# Altium schematic sheet TDC.SchDoc: FMC_ADC
size 420 x 297 mm; Author: G.Kasprowicz; CompanyName: WUT ISE; DrawnBy: G.Kasprowicz; Organization: WUT ISE; Address1: PW ISE; Address2: Nowowiejska 15/19 00-665 Warsaw; Address3: gkasprow@gmail.com; Revision: 2; SheetNumber: -; SheetTotal: -; ModifiedBy: -; CheckedDate: -; Title2: quad TDC; DivGrp: WUT ISE; Designer: G.Kasprowicz; ModifiedDate: -; ProjectName: Sensor Box
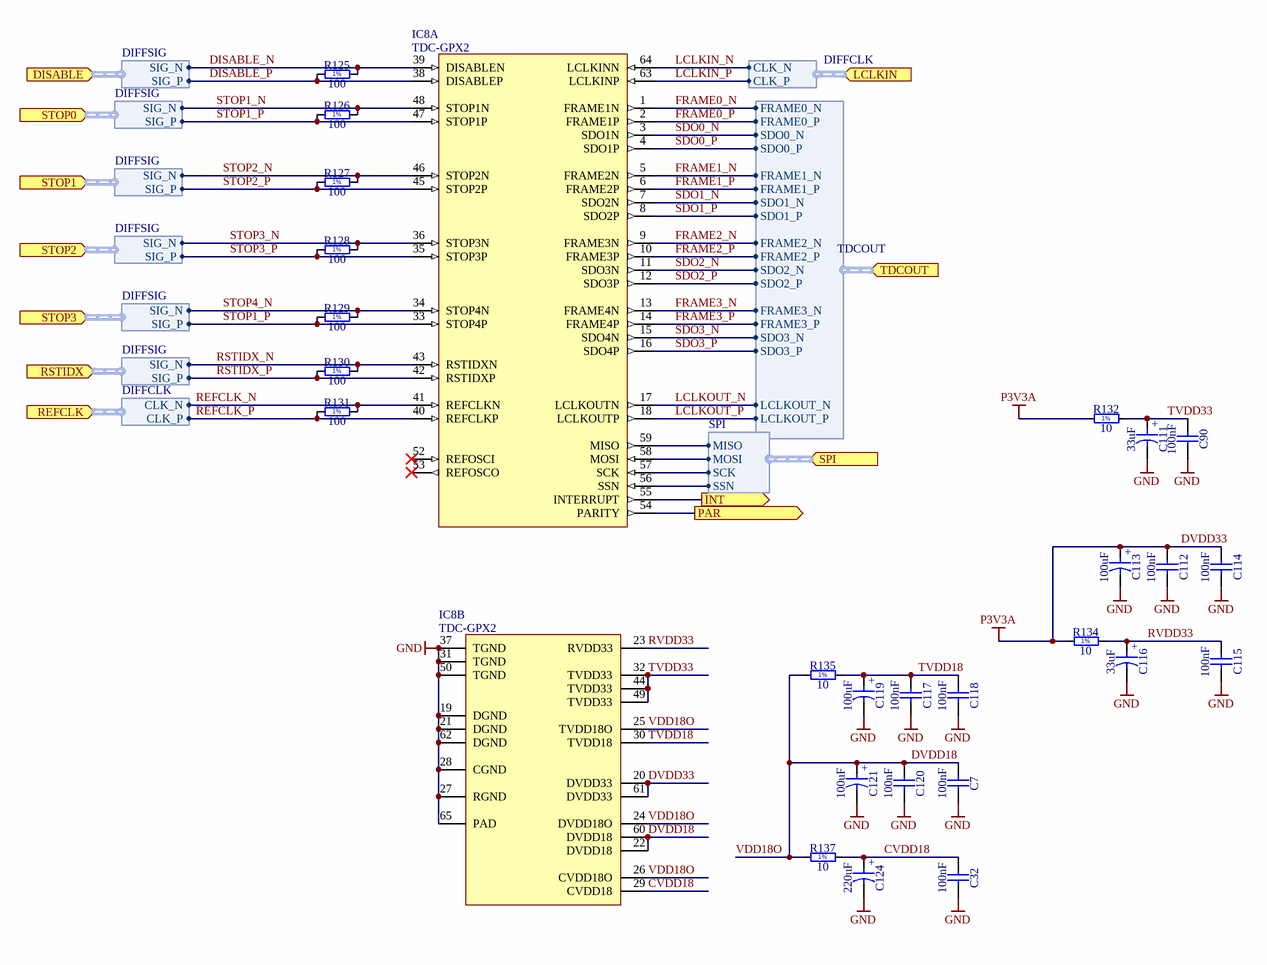
[diagram p0: TDC.SchDoc]

## Parts
C7  100nF  [CAPC0603X33N]
C32  100nF  [CAPC0603X33N]
C90  100nF  [CAPC0603X33N]
C111  33uF  [CAPMP3216X180N]
C112  100nF  [CAPC0603X33N]
C113  100uF  [CAPMP3216X180N]
C114  100nF  [CAPC0603X33N]
C115  100nF  [CAPC0603X33N]
C116  33uF  [CAPMP3216X180N]
C117  100nF  [CAPC0603X33N]
C118  100nF  [CAPC0603X33N]
C119  100uF  [CAPMP3216X180N]
C120  100nF  [CAPC0603X33N]
C121  100uF  [CAPMP3216X180N]
C124  220uF  [CAPMP3528X210N]
IC8  TDC-GPX2  [QFN50P900X900X100-65N-S615]  (parts A,B of 2)
R125  100  [RESC0603X28N]
R126  100  [RESC0603X28N]
R127  100  [RESC0603X28N]
R128  100  [RESC0603X28N]
R129  100  [RESC0603X28N]
R130  100  [RESC0603X28N]
R131  100  [RESC0603X28N]
R132  10  [RESC1005X40N]
R134  10  [RESC1005X40N]
R135  10  [RESC1005X40N]
R137  10  [RESC1005X40N]

## Ports
DISABLE (in, harness DIFFSIG), INT (out), LCLKIN (in, harness DIFFCLK), PAR (out), REFCLK (in, harness DIFFCLK), RSTIDX (in, harness DIFFSIG), SPI (in, harness SPI), STOP0 (in, harness DIFFSIG), STOP1 (in, harness DIFFSIG), STOP2 (in, harness DIFFSIG), STOP3 (in, harness DIFFSIG), TDCOUT (in, harness TDCOUT)

## Harnesses
DIFFCLK: CLK_P, CLK_N
TDCOUT: FRAME0_N, FRAME0_P, SDO0_N, SDO0_P, FRAME1_N, FRAME1_P, SDO1_N, SDO1_P, FRAME2_N, FRAME2_P, SDO2_N, SDO2_P, FRAME3_N, FRAME3_P, SDO3_N, SDO3_P, LCLKOUT_N, LCLKOUT_P
SPI: MISO, MOSI, SCK, SSN
DIFFSIG: SIG_P, SIG_N

## Nets
DVDD33: C112.1 C113.1 C114.1 IC8.20(DVDD33) IC8.61(DVDD33) R132.1 R134.1  [also labelled P3V3A]
GND: C7.2 C32.2 C90.2 C111.2 C112.2 C113.2 C114.2 C115.2 C116.2 C117.2 C118.2 C119.2 C120.2 C121.2 C124.2 IC8.19(DGND) IC8.21(DGND) IC8.27(RGND) IC8.28(CGND) IC8.31(TGND) IC8.37(TGND) IC8.50(TGND) IC8.62(DGND) IC8.65(PAD)
CVDD18: C32.1 C124.1 IC8.29(CVDD18) R137.2
DISABLE_N: IC8.39(DISABLEN) R125.2 ; port DISABLE.SIG_N
DISABLE_P: IC8.38(DISABLEP) R125.1 ; port DISABLE.SIG_P
DVDD18: C7.1 C120.1 C121.1 IC8.22(DVDD18) IC8.24(DVDD18O) IC8.25(TVDD18O) IC8.26(CVDD18O) IC8.60(DVDD18) R135.1 R137.1  [also labelled VDD18O]
FRAME0_N: IC8.1(FRAME1N) ; port TDCOUT.FRAME0_N
FRAME0_P: IC8.2(FRAME1P) ; port TDCOUT.FRAME0_P
FRAME1_N: IC8.5(FRAME2N) ; port TDCOUT.FRAME1_N
FRAME1_P: IC8.6(FRAME2P) ; port TDCOUT.FRAME1_P
FRAME2_N: IC8.9(FRAME3N) ; port TDCOUT.FRAME2_N
FRAME2_P: IC8.10(FRAME3P) ; port TDCOUT.FRAME2_P
FRAME3_N: IC8.13(FRAME4N) ; port TDCOUT.FRAME3_N
FRAME3_P: IC8.14(FRAME4P) ; port TDCOUT.FRAME3_P
INT: IC8.55(INTERRUPT) ; port INT
LCLKIN_N: IC8.64(LCLKINN) ; port LCLKIN.CLK_N
LCLKIN_P: IC8.63(LCLKINP) ; port LCLKIN.CLK_P
LCLKOUT_N: IC8.17(LCLKOUTN) ; port TDCOUT.LCLKOUT_N
LCLKOUT_P: IC8.18(LCLKOUTP) ; port TDCOUT.LCLKOUT_P
PAR: IC8.54(PARITY) ; port PAR
REFCLK_N: IC8.41(REFCLKN) R131.2 ; port REFCLK.CLK_N
REFCLK_P: IC8.40(REFCLKP) R131.1 ; port REFCLK.CLK_P
RSTIDX_N: IC8.43(RSTIDXN) R130.2 ; port RSTIDX.SIG_N
RSTIDX_P: IC8.42(RSTIDXP) R130.1 ; port RSTIDX.SIG_P
RVDD33: C115.1 C116.1 IC8.23(RVDD33) R134.2
SDO0_N: IC8.3(SDO1N) ; port TDCOUT.SDO0_N
SDO0_P: IC8.4(SDO1P) ; port TDCOUT.SDO0_P
SDO1_N: IC8.7(SDO2N) ; port TDCOUT.SDO1_N
SDO1_P: IC8.8(SDO2P) ; port TDCOUT.SDO1_P
SDO2_N: IC8.11(SDO3N) ; port TDCOUT.SDO2_N
SDO2_P: IC8.12(SDO3P) ; port TDCOUT.SDO2_P
SDO3_N: IC8.15(SDO4N) ; port TDCOUT.SDO3_N
SDO3_P: IC8.16(SDO4P) ; port TDCOUT.SDO3_P
STOP1_N: IC8.48(STOP1N) R126.2 ; port STOP0.SIG_N
STOP1_P: IC8.33(STOP4P) IC8.47(STOP1P) R126.1 R129.1 ; port STOP0.SIG_P, port STOP3.SIG_P
STOP2_N: IC8.46(STOP2N) R127.2 ; port STOP1.SIG_N
STOP2_P: IC8.45(STOP2P) R127.1 ; port STOP1.SIG_P
STOP3_N: IC8.36(STOP3N) R128.2 ; port STOP2.SIG_N
STOP3_P: IC8.35(STOP3P) R128.1 ; port STOP2.SIG_P
STOP4_N: IC8.34(STOP4N) R129.2 ; port STOP3.SIG_N
TVDD18: C117.1 C118.1 C119.1 IC8.30(TVDD18) R135.2
TVDD33: C90.1 C111.1 IC8.32(TVDD33) IC8.44(TVDD33) IC8.49(TVDD33) R132.2
NetIC8_56: IC8.56(SSN) ; port SPI.SSN
NetIC8_57: IC8.57(SCK) ; port SPI.SCK
NetIC8_58: IC8.58(MOSI) ; port SPI.MOSI
NetIC8_59: IC8.59(MISO) ; port SPI.MISO

Not connected (* = marked no-connect by the designer): IC8 52(REFOSCI)* 53(REFOSCO)*

## Notes on the sheet
- Project/Equipment
- Document
- Designer
- Drawn by
- Check.by
- Copyright WUT ISE 2018.
  This documentation describes Open Hardware and is licensed under the CERN OHL v.1.1. You may redistribute and modify this documentation under the terms of the CERN OHL v.1.1. (http://ohwr.org/CERNOHL). This documentation is distributed WITHOUT ANY EXPRESS OR IMPLIED WARRANTY, INCLUDING OF MERCHANTABILITY, SATISFACTORY QUALITY AND FITNESS FOR A PARTICULAR PURPOSE. Please see the CERN OHL v.1.1 for applicable conditions.
- Contact
- File
- Last Mod.
- Print Date
- Sheet
- Size
- A3
- of
- Rev
- (in symbol CTE3216-18_33UF_4V_10%) +
- (in symbol CTE3216-18_100UF_6.3V_20%_ESR0500_AVX_TLJ) +
- (in symbol CTE3528-21_220UF_2.5V_10%) +
- (in symbol R0201_100R_1%_0.05W_200PPM) 1%
- (in symbol R0402_10R_1%_0.0625W_200PPM) 1%

## Library data of the parts
C7 C114 = CC0201_100NF_6.3V_10%_X5R: Non-polarised capacitor; Part Description: SMD Multilayer Chip Ceramic Capacitor; Manufacturer: GENERIC; Manufacturer1 Part Number: 02016D104KAT2A; Voltage: 6.3V; Tolerance: ±10%; TC: X5R; Part Number: CC0201_100NF_6.3V_10%_X5R; Component Kind: Standard; Component Type: Standard; Pin Count: 2; Value: 100nF; Status: Not Recommended; Manufacturer Part Number: CC0201_100NF_6.3V_10%_X5R; Case: 0201; Mounted: Yes; Socket: No; SMD: Yes; Sense: No; Manufacturer1 Example: AVX; Manufacturer1 ComponentHeight: 0.33mm; HelpURL: \\cern.ch\dfs\Applications\Altium\Datasheets\CC0201_X5R_AVX.pdf; Author: CERN DEM JLC; CreateDate: 03.12.2007; LatestRevisionDate: 03.12.2007
C32 C90 C112 C115 C117 C118 C120 = CC0201_100NF_6.3V_10%_X5R: Non-polarised capacitor; Part Description: SMD Multilayer Chip Ceramic Capacitor; Manufacturer: GENERIC; Manufacturer1 Part Number: 02016D104KAT2A; Voltage: 6.3V; TC: X5R; Tolerance: ±10%; Part Number: CC0201_100NF_6.3V_10%_X5R; Component Kind: Standard; Component Type: Standard; Pin Count: 2; Value: 100nF; Status: Not Recommended; Manufacturer Part Number: CC0201_100NF_6.3V_10%_X5R; Case: 0201; Mounted: Yes; Socket: No; SMD: Yes; Sense: No; Manufacturer1 Example: AVX; Manufacturer1 ComponentHeight: 0.33mm; HelpURL: \\cern.ch\dfs\Applications\Altium\Datasheets\CC0201_X5R_AVX.pdf; Author: CERN DEM JLC; CreateDate: 03.12.2007; LatestRevisionDate: 03.12.2007
C111 C116 = CTE3216-18_33UF_4V_10%: Polarised capacitor; Part Description: Solid Tantalum Chip Capacitor; Manufacturer: GENERIC; Manufacturer1 Part Number: TAJA336K004R; Voltage: 4V; Tolerance: ±10%; Part Number: CTE3216-18_33UF_4V_10%; Component Kind: Standard; Component Type: Standard; Pin Count: 2; Value: 33uF; Status: Preferred; Manufacturer Part Number: CTE3216-18_33UF_4V_10%; Case: A; Mounted: Yes; Socket: No; SMD: Yes; Sense: No; Manufacturer1 Example: AVX; Manufacturer1 ComponentHeight: 1.8mm; HelpURL: \\cern.ch\dfs\Applications\Altium\Datasheets\CTE_AVX_TAJ.pdf; Author: CERN DEM JLC; CreateDate: 03.12.2007; LatestRevisionDate: 03.12.2007
C113 C119 C121 = CTE3216-18_100UF_6.3V_20%_ESR0500_AVX_TLJ: Polarised capacitor; Part Description: ESR 0R5 Solid Tantalum Chip Capacitor; Manufacturer: AVX; Manufacturer Part Number: TLJA107M006R0500; Voltage: 6.3V; Tolerance: ±20%; Part Number: CTE3216-18_100UF_6.3V_20%_ESR0500_AVX_TLJ; Component Kind: Standard; Component Type: Standard; Pin Count: 2; Value: 100uF; Status: None; Case: A; Mounted: Yes; Socket: No; SMD: Yes; Sense: No; HelpURL: \\cern.ch\dfs\Applications\Altium\Datasheets\CTE_AVX_TLJ.pdf; Author: CERN DEM JLC; CreateDate: 19.12.2013; LatestRevisionDate: 19.12.2013; ComponentHeight: 1.8mm
C124 = CTE3528-21_220UF_2.5V_10%: Polarised capacitor; Part Description: Solid Tantalum Chip Capacitor; Manufacturer: GENERIC; Manufacturer1 Part Number: TAJB227K002R; Voltage: 2.5V; Tolerance: ±10%; Part Number: CTE3528-21_220UF_2.5V_10%; Component Kind: Standard; Component Type: Standard; Pin Count: 2; Value: 220uF; Status: Preferred; Manufacturer Part Number: CTE3528-21_220UF_2.5V_10%; Case: B; Mounted: Yes; Socket: No; SMD: Yes; Sense: No; Manufacturer1 Example: AVX; Manufacturer1 ComponentHeight: 2.1mm; HelpURL: \\cern.ch\dfs\Applications\Altium\Datasheets\CTE_AVX_TAJ.pdf; Author: CERN DEM JLC; CreateDate: 03.12.2007; LatestRevisionDate: 03.12.2007
IC8 = TDC-GPX2: 4-Channel Time-to-Digital Converter; Manufacturer: ACAM MESS-ELECTRONIC; PressFit: No; Bonding: No; Part Number: TDC-GPX2; Component Kind: Standard; Component Type: Standard; Device: TDC-GPX2; PackageDescription: QFN,0.50mm pitch,square;64 pin,9.00mm L X 9.00mm W X 1.00mm H body (6.15mm X 6.15mm thermal tab), IPC Medium Density; Part Description: 4-Channel Time-to-Digital Converter; Manufacturer Part Number: TDC-GPX2; Pin Count: 65; Case: QFN64; Mounted: Yes; Socket: No; SMD: Yes; Sense: No; ComponentHeight: 1.2mm; Author: GK; HelpURL: \\cern.ch\dfs\Applications\Altium\Datasheets\TDC-GPX.pdf; CreateDate: 05.07.2010; LatestRevisionDate: 05.07.2010
R125-R131 = R0201_100R_1%_0.05W_200PPM: Resistor - 1%; Part Description: Thick Film Chip Resistor; Manufacturer: GENERIC; Manufacturer1 Part Number: CRCW0201100RFNED; Power: 0.05W; TC: ±200ppm/°C; PressFit: No; Part Number: R0201_100R_1%_0.05W_200PPM; Component Kind: Standard; Component Type: Standard; Pin Count: 2; Value: 100; Status: Not Recommended; Tolerance: ±1%; Manufacturer Part Number: R0201_100R_1%_0.05W_200PPM; Case: 0201; Mounted: Yes; Sense: No; Socket: No; SMD: Yes; Manufacturer1 Example: VISHAY; Manufacturer1 ComponentHeight: 0.27mm; HelpURL: \\cern.ch\dfs\Applications\Altium\Datasheets\R0201_VISHAY_CRCW0201 e3.pdf; Author: CERN DEM JLC; CreateDate: 13.11.2014; LatestRevisionDate: 13.11.2014
R132 R134 R135 R137 = R0402_10R_1%_0.0625W_200PPM: Resistor - 1%; Part Description: General Purpose Thick Film Chip Resistor; Manufacturer: GENERIC; Manufacturer1 Part Number: 232270671009L; TC: ±200ppm/°C; PressFit: No; Part Number: R0402_10R_1%_0.0625W_200PPM; Component Kind: Standard; Component Type: Standard; Pin Count: 2; Value: 10; Status: Not Recommended; Power: 0.0625W; Tolerance: ±1%; Manufacturer Part Number: R0402_10R_1%_0.0625W_200PPM; Case: 0402; Mounted: Yes; Sense: No; Socket: No; SMD: Yes; Manufacturer1 Example: YAGEO PHYCOMP; Manufacturer1 ComponentHeight: 0.4mm; HelpURL: \\cern.ch\dfs\Applications\Altium\Datasheets\R0402_Phycomp_RC0402.pdf; Author: CERN DEM JLC; CreateDate: 24.06.2009; LatestRevisionDate: 17.10.2012